# EAGLE design OSSIEPSSuperCap (EAGLE 6.1)
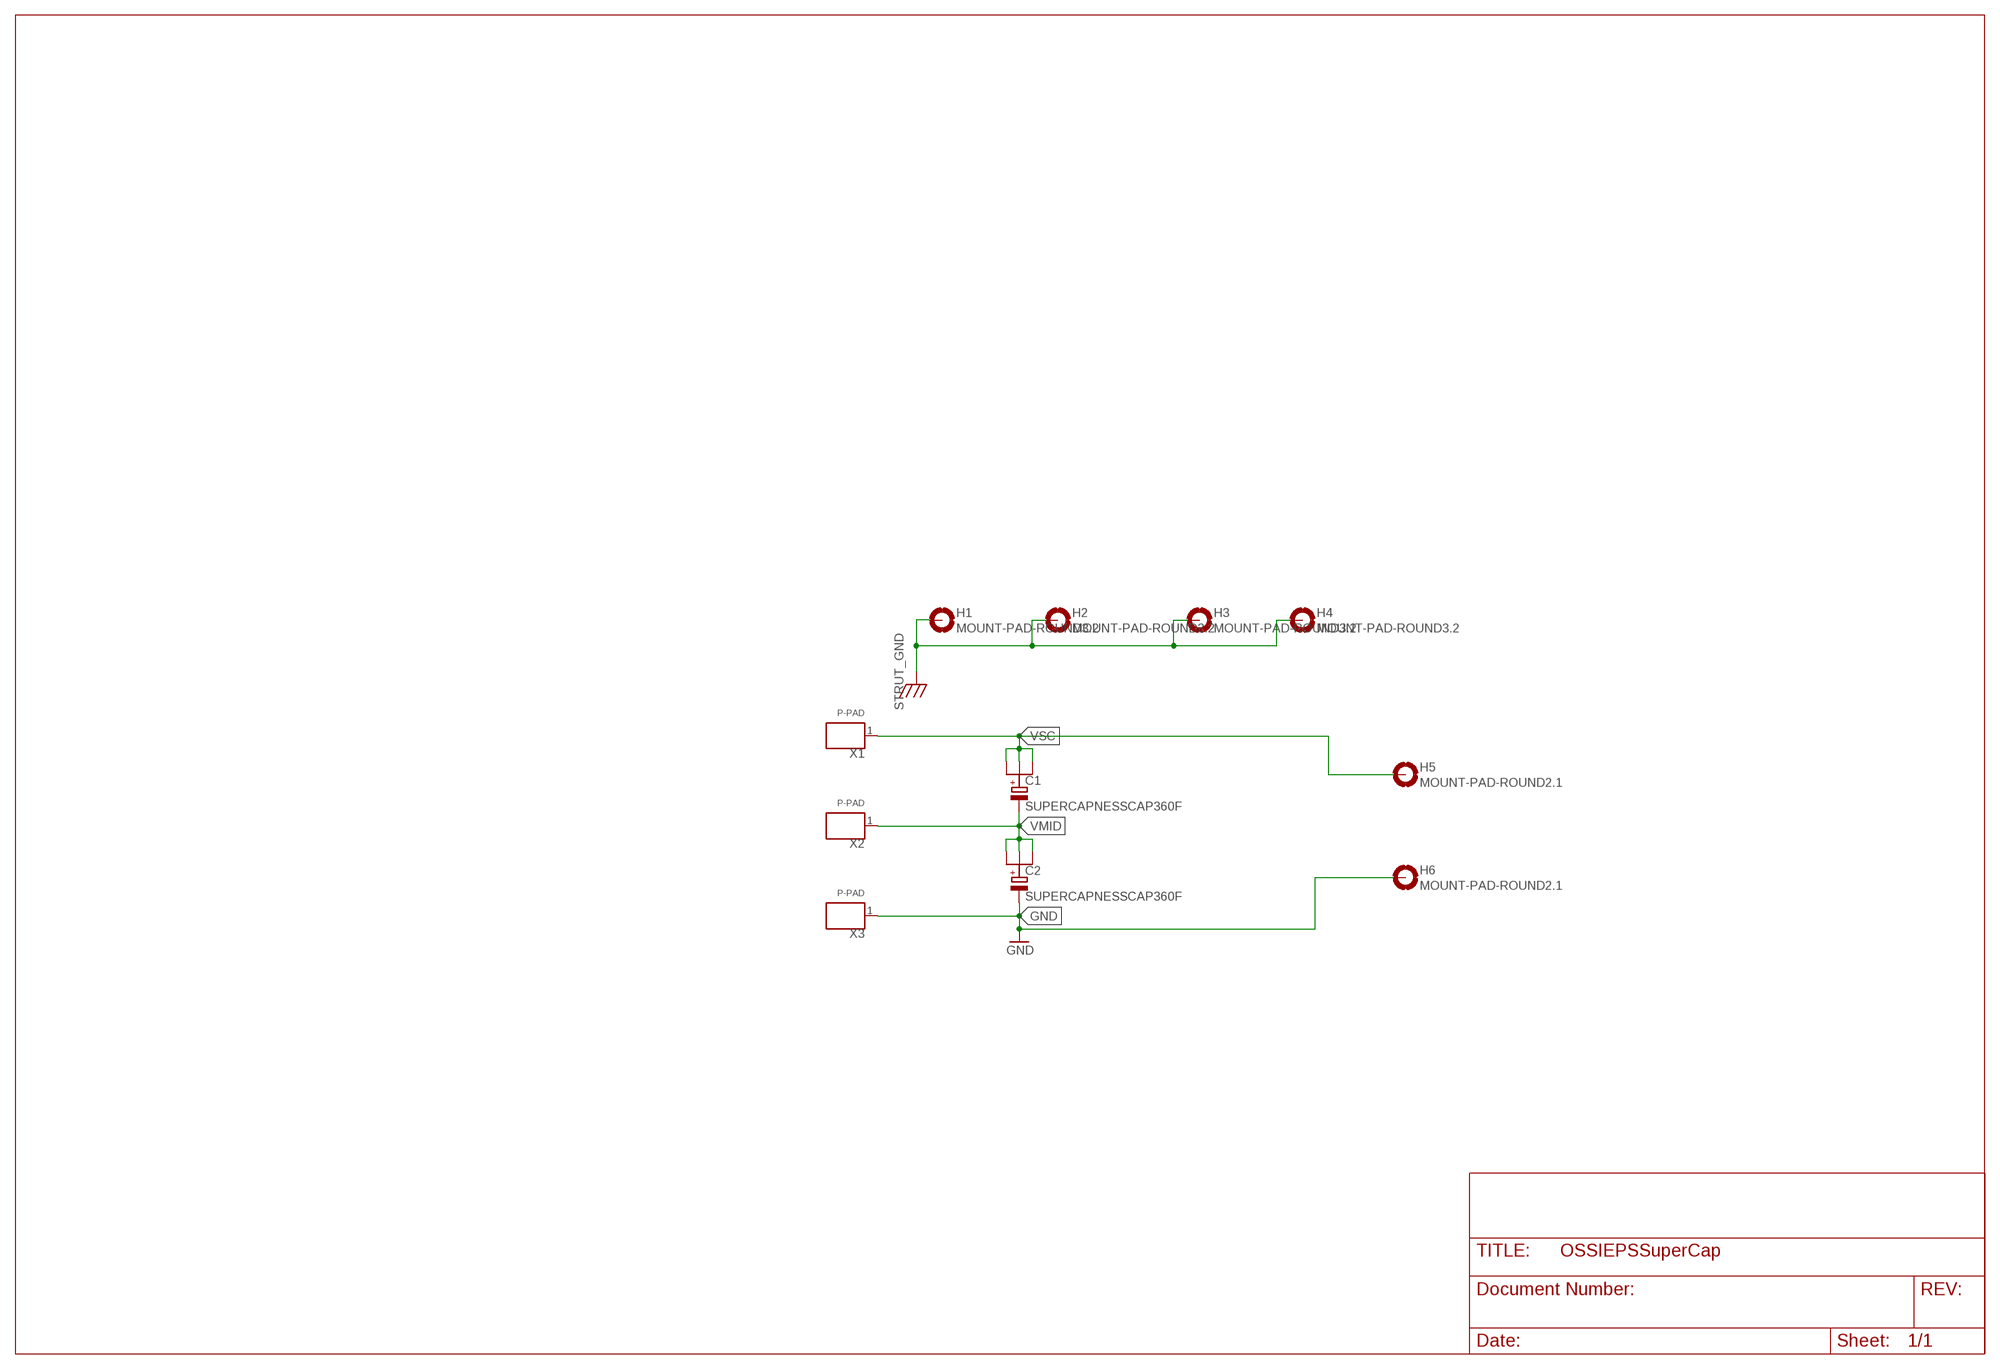
[diagram p0: schematic, sheet 1]

## Parts
C1  SUPERCAPNESSCAP360F  [NESSCAP360F]
C2  SUPERCAPNESSCAP360F  [NESSCAP360F]
H1  MOUNT-PAD-ROUND3.2  [3.2-PAD-ROUND]
H2  MOUNT-PAD-ROUND3.2  [3.2-PAD-ROUND]
H3  MOUNT-PAD-ROUND3.2  [3.2-PAD-ROUND]
H4  MOUNT-PAD-ROUND3.2  [3.2-PAD-ROUND]
H5  MOUNT-PAD-ROUND2.1  [2.1-PAD-ROUND]
H6  MOUNT-PAD-ROUND2.1  [2.1-PAD-ROUND]
X1  P-PAD  [P-PAD]
X2  P-PAD  [P-PAD]
X3  P-PAD  [P-PAD]

## Nets
GND: C2.N H6.B3,2(MOUNT) X3.1
STRUT_GND: H1.B3,2(MOUNT) H2.B3,2(MOUNT) H3.B3,2(MOUNT) H4.B3,2(MOUNT)
VMID: C1.N C2.P1 C2.P2 C2.P3 X2.1
VSC: C1.P1 C1.P2 C1.P3 H5.B3,2(MOUNT) X1.1

## Library data of the parts
C1 C2 = OSSI:SUPERCAP: Nesscap SuperCap
H1-H6 = OSSI:MOUNT-PAD-ROUND
X1-X3 = OSSI:P-PAD

## Board
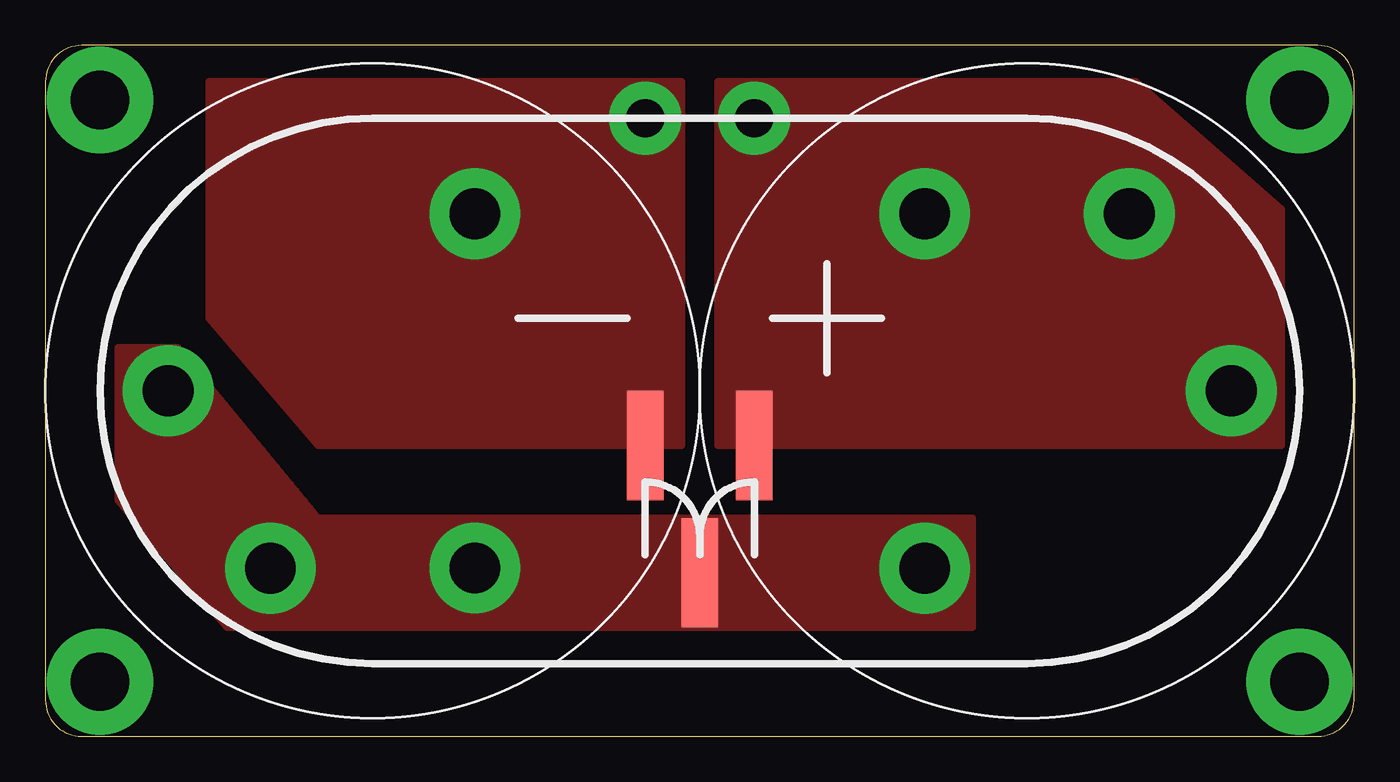
[diagram p1: board, top side]
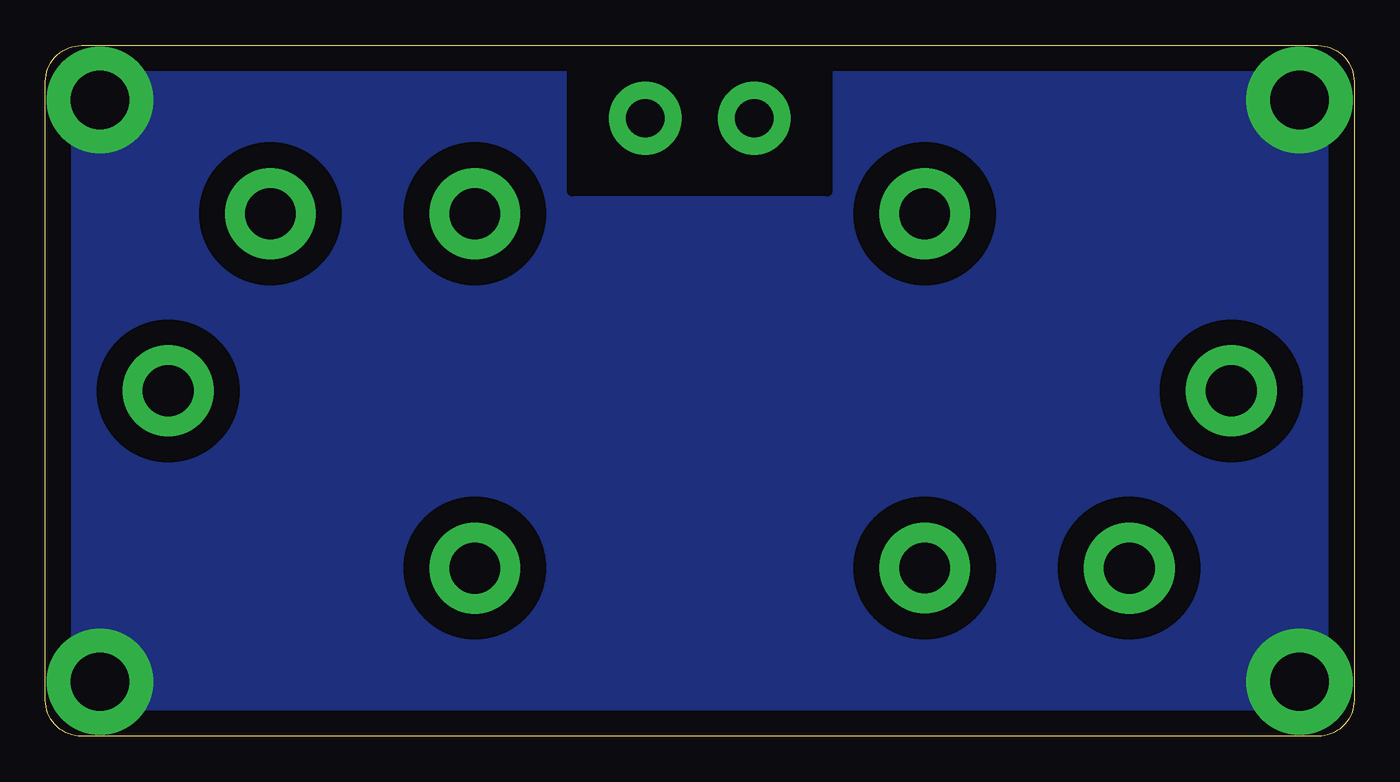
[diagram p2: board, bottom side, seen from below]

Size 72 x 38 mm. Coordinates in mm from the lower left corner, seen from the top.
Outline: 72,2 72,36 arc90 70,38 2,38 arc90 0,36 0,2 arc90 2,0 70,0 arc90 72,2
Copper layers (1*16): Top 0.035mm / dielectric 1.5mm / Bottom 0.035mm
Design rules: minimum track width 10mil, minimum drill 24mil, track to track 8mil, track to pad 8mil, pad to pad 8mil, via to via 8mil, smd to smd 8mil, copper to edge 40mil, drill to drill 8mil, minimum pad ring 10mil, minimum via ring 8mil, stop-mask expansion 4mil, vias tented up to drill 0mil, thermal gap 10mil

### Footprints (pad centres in the part's own frame; a part is rotated, then mirrored left to right if it is on the bottom)
NESSCAP360F = drill 2.8 pad 5: N 0,11.25; P1 -9.74,-5.625; P2 0,-11.25; P3 9.74,-5.625
3.2-PAD-ROUND = drill 3.2 pad 5.842: B3,2 0,0
2.1-PAD-ROUND = drill 2.1 pad 4: B3,2 0,0
P-PAD = smd 6 x 2: 1 0,0

### Placement (x,y rotation side)
C1  54,19 150 top
C2  18,19 330 top
H1  69,35 180 top
H2  3,35 180 top
H3  69,3 180 top
H4  3,3 180 top
H5  39,34 0 top
H6  33,34 0 top
X1  39,16 270 top
X2  36,9 270 top
X3  33,16 270 top

### Tracks (layer width: path | path; a pad name or v marks a point on that pad's centre or on a via)
GND
  pour Top (no thermals): 35,36 9,36 9,23 15,16 35,16
N$1
  cutout Bottom (no thermals): 29,38 29,30 43,30 43,38
STRUT_GND
  pour Bottom (isolate 1.422, no thermals): 0,38 72,38 72,0 0,0
VMID
  pour Top (no thermals): 15,12 7.27,21.36 4,21.36 4,13 10,6 51,6 51,12
VSC
  pour Top (no thermals): 37,36 37,16 68,16 68,29 60,36